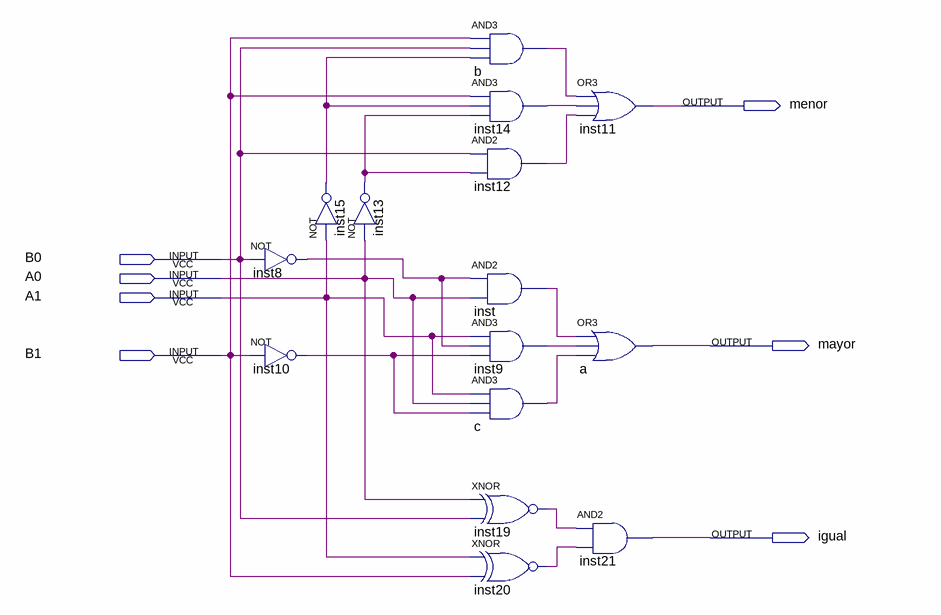
[diagram p0: schematic sheet]
// Quartus schematic compa2bits.bdf as structural Verilog: 15 symbols, 7 pins
module compa2bits (
  input  B0,
  input  A0,
  input  A1,
  input  B1,
  output menor,
  output mayor,
  output igual
);

  wire b_out, c_out, inst8_out, inst9_out, inst10_out, inst12_out, inst13_out, inst14_out, inst15_out,
       inst19_out, inst20_out, inst_out;

  not inst8 (inst8_out, B0);
  not inst10 (inst10_out, B1);
  not inst13 (inst13_out, A0);
  not inst15 (inst15_out, A1);
  and b (b_out, B1, B0, inst15_out);
  and inst14 (inst14_out, B1, inst15_out, inst13_out);
  and inst12 (inst12_out, B0, inst13_out);
  and inst (inst_out, inst8_out, A0);
  and inst9 (inst9_out, A1, inst8_out, inst10_out);
  and c (c_out, A1, A0, inst10_out);
  xnor inst19 (inst19_out, A0, B0);
  xnor inst20 (inst20_out, A1, B1);
  or inst11 (menor, b_out, inst14_out, inst12_out);
  or a (mayor, inst_out, inst9_out, c_out);
  and inst21 (igual, inst19_out, inst20_out);
endmodule
